# Altium schematic sheet GP2Y_v3_eth.SchDoc
size A1
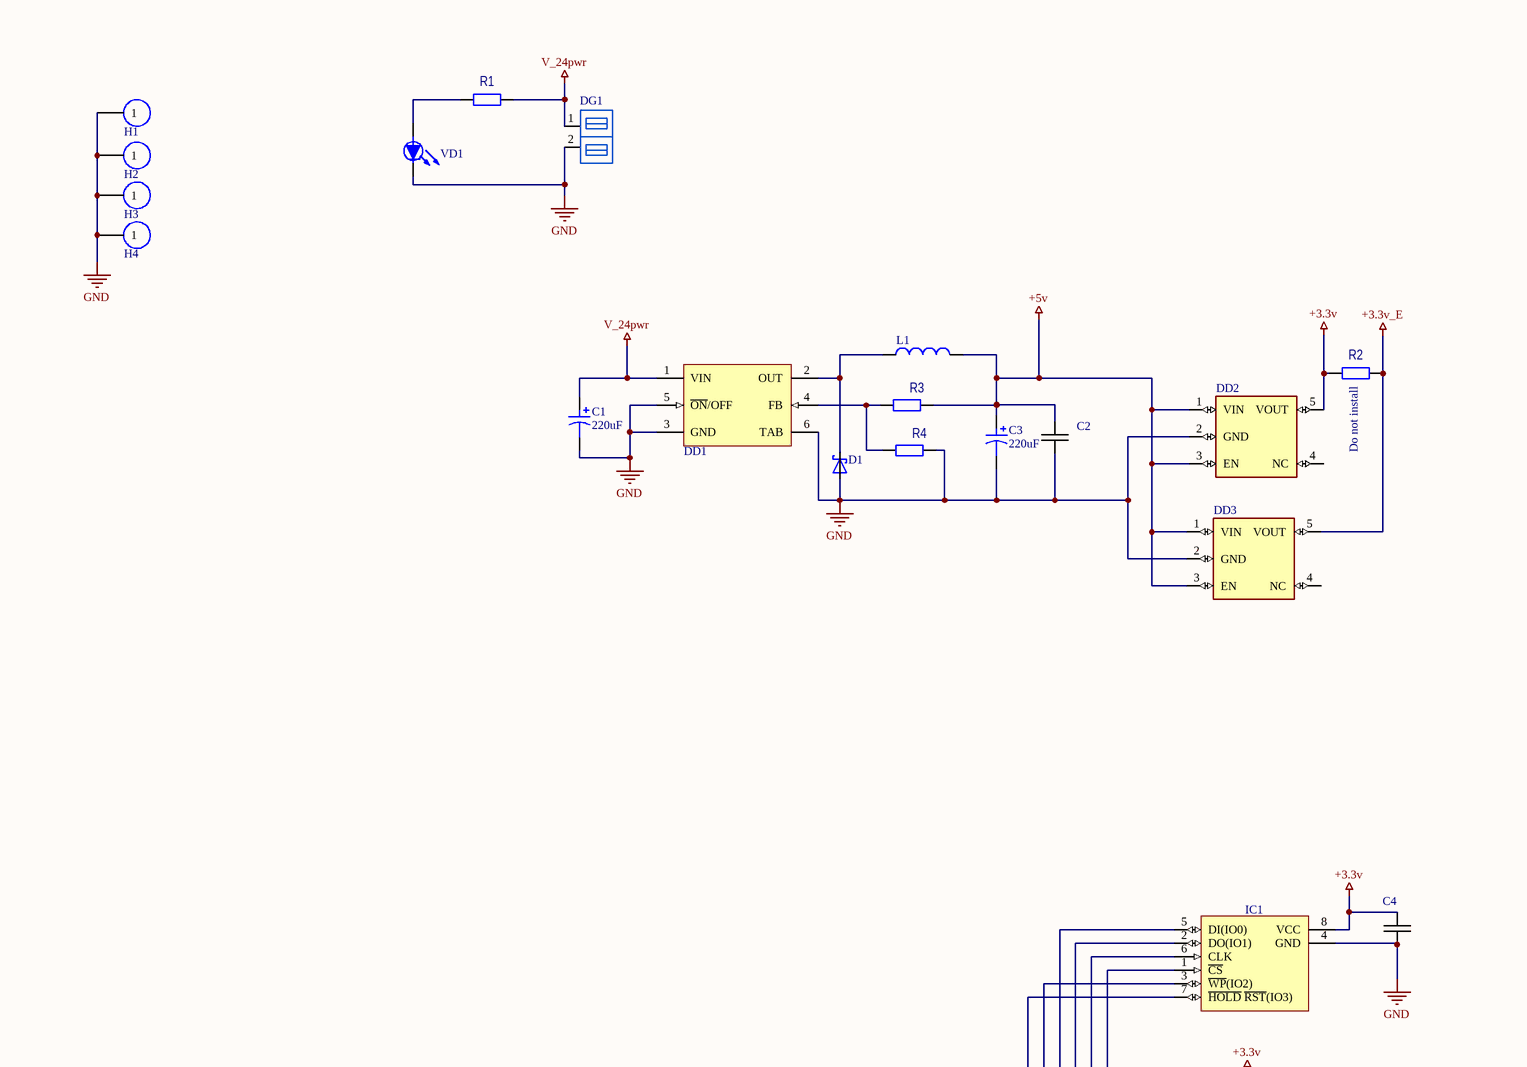
[diagram p0: GP2Y_v3_eth.SchDoc, top left]
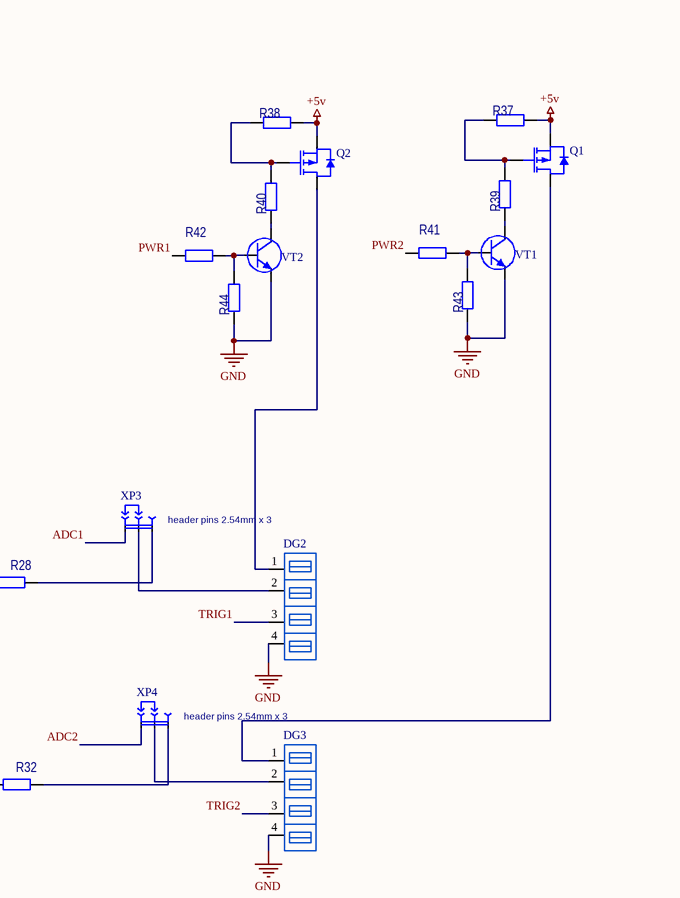
[diagram p1: GP2Y_v3_eth.SchDoc, top right]
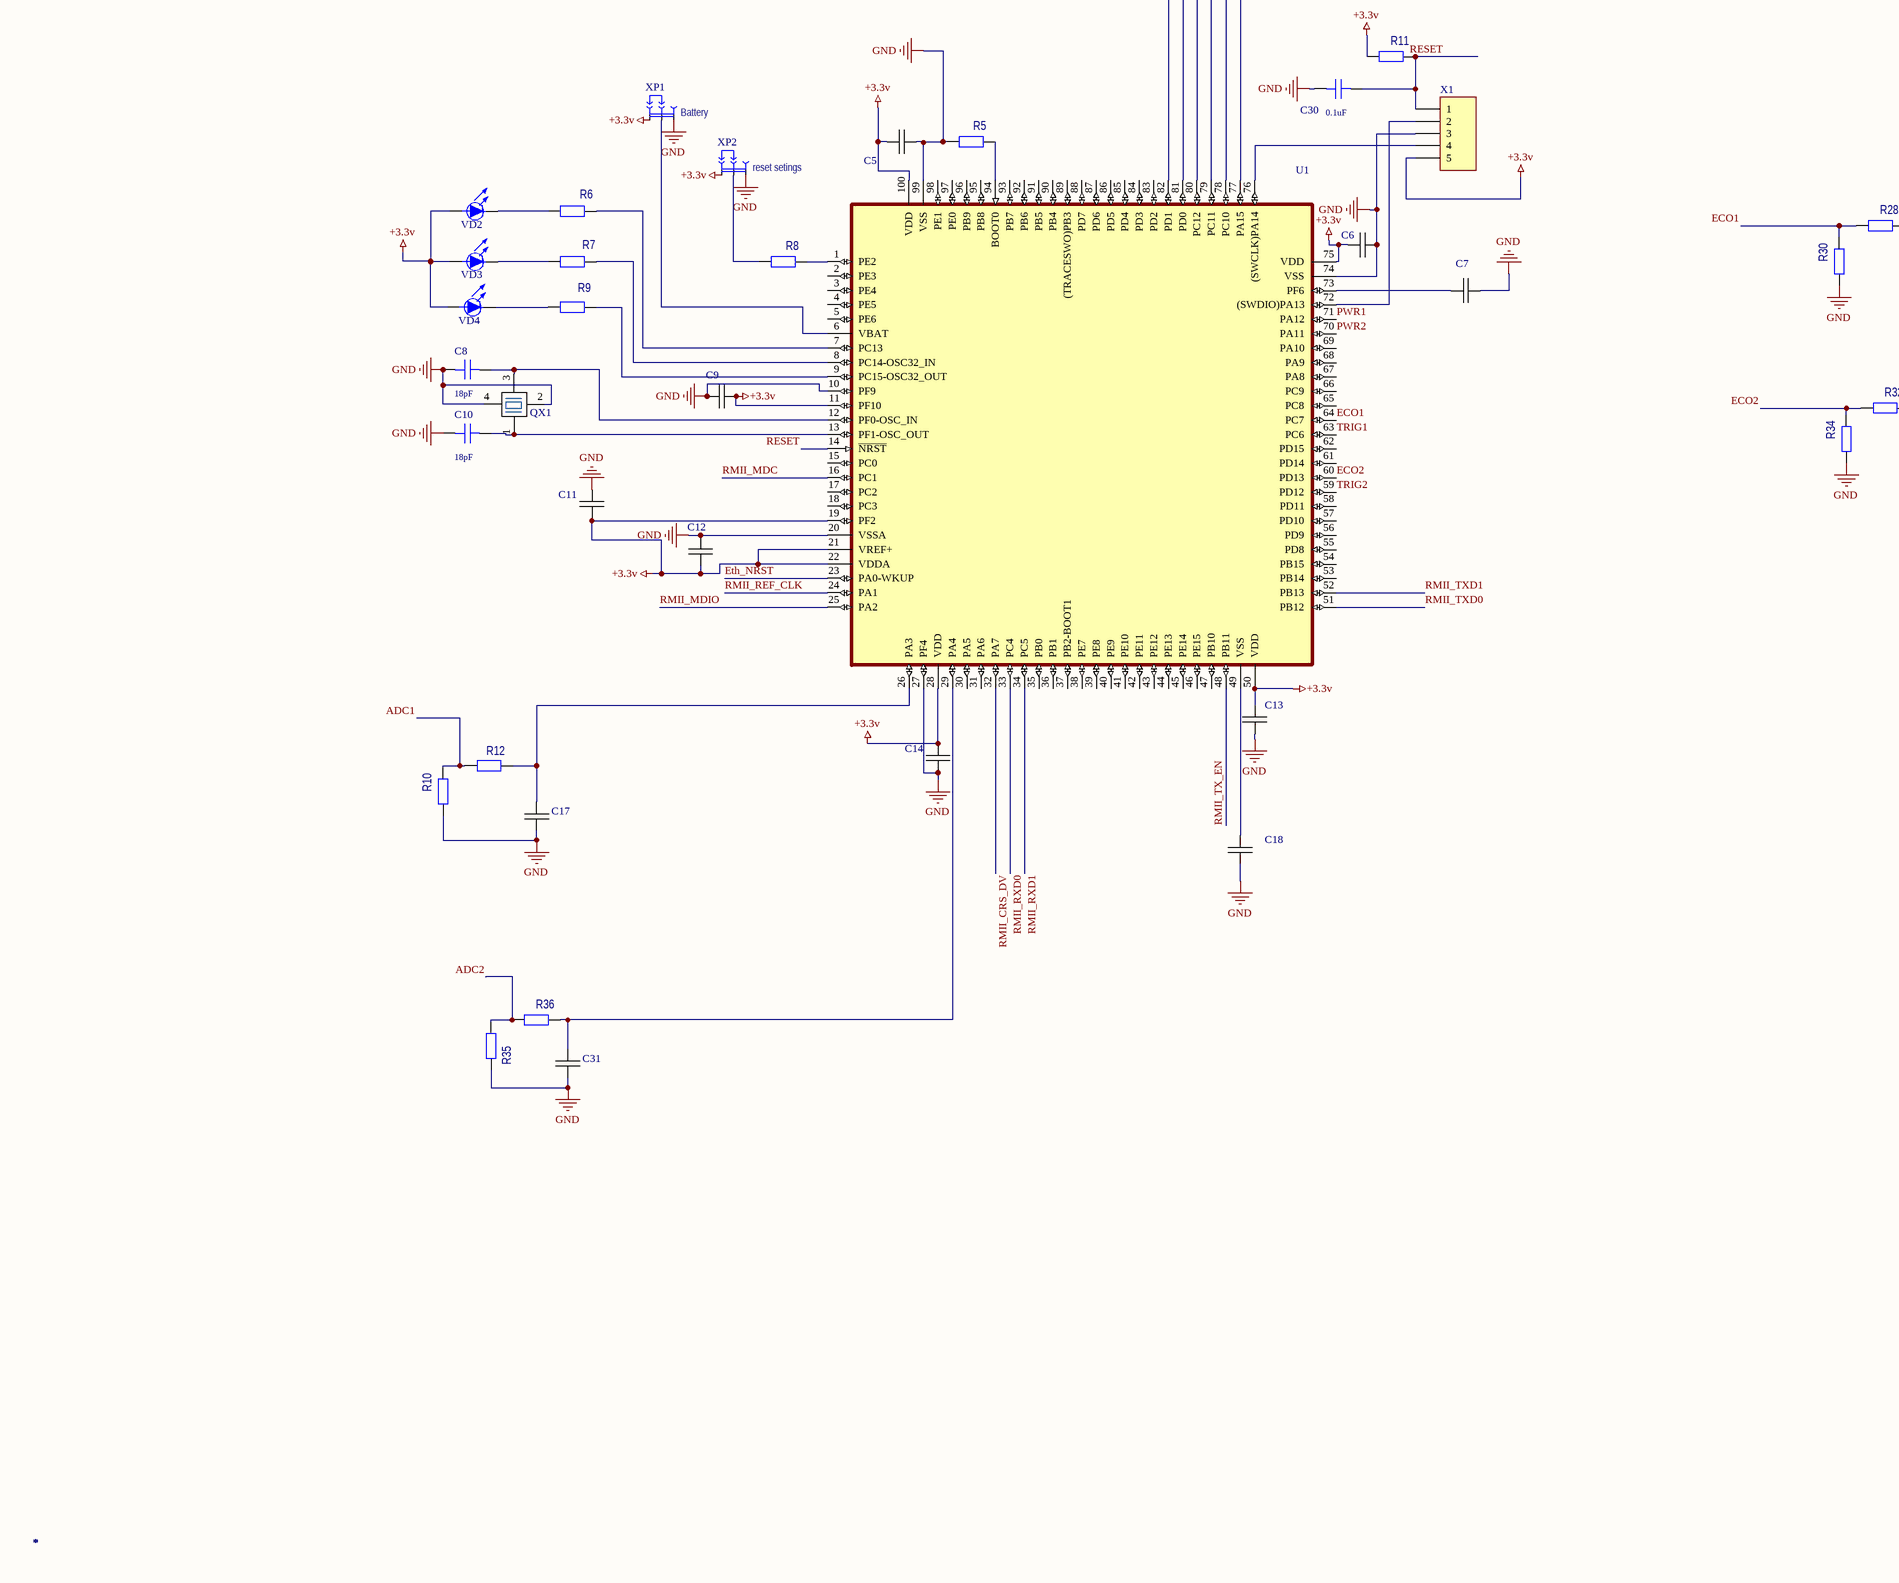
[diagram p2: GP2Y_v3_eth.SchDoc, bottom left]
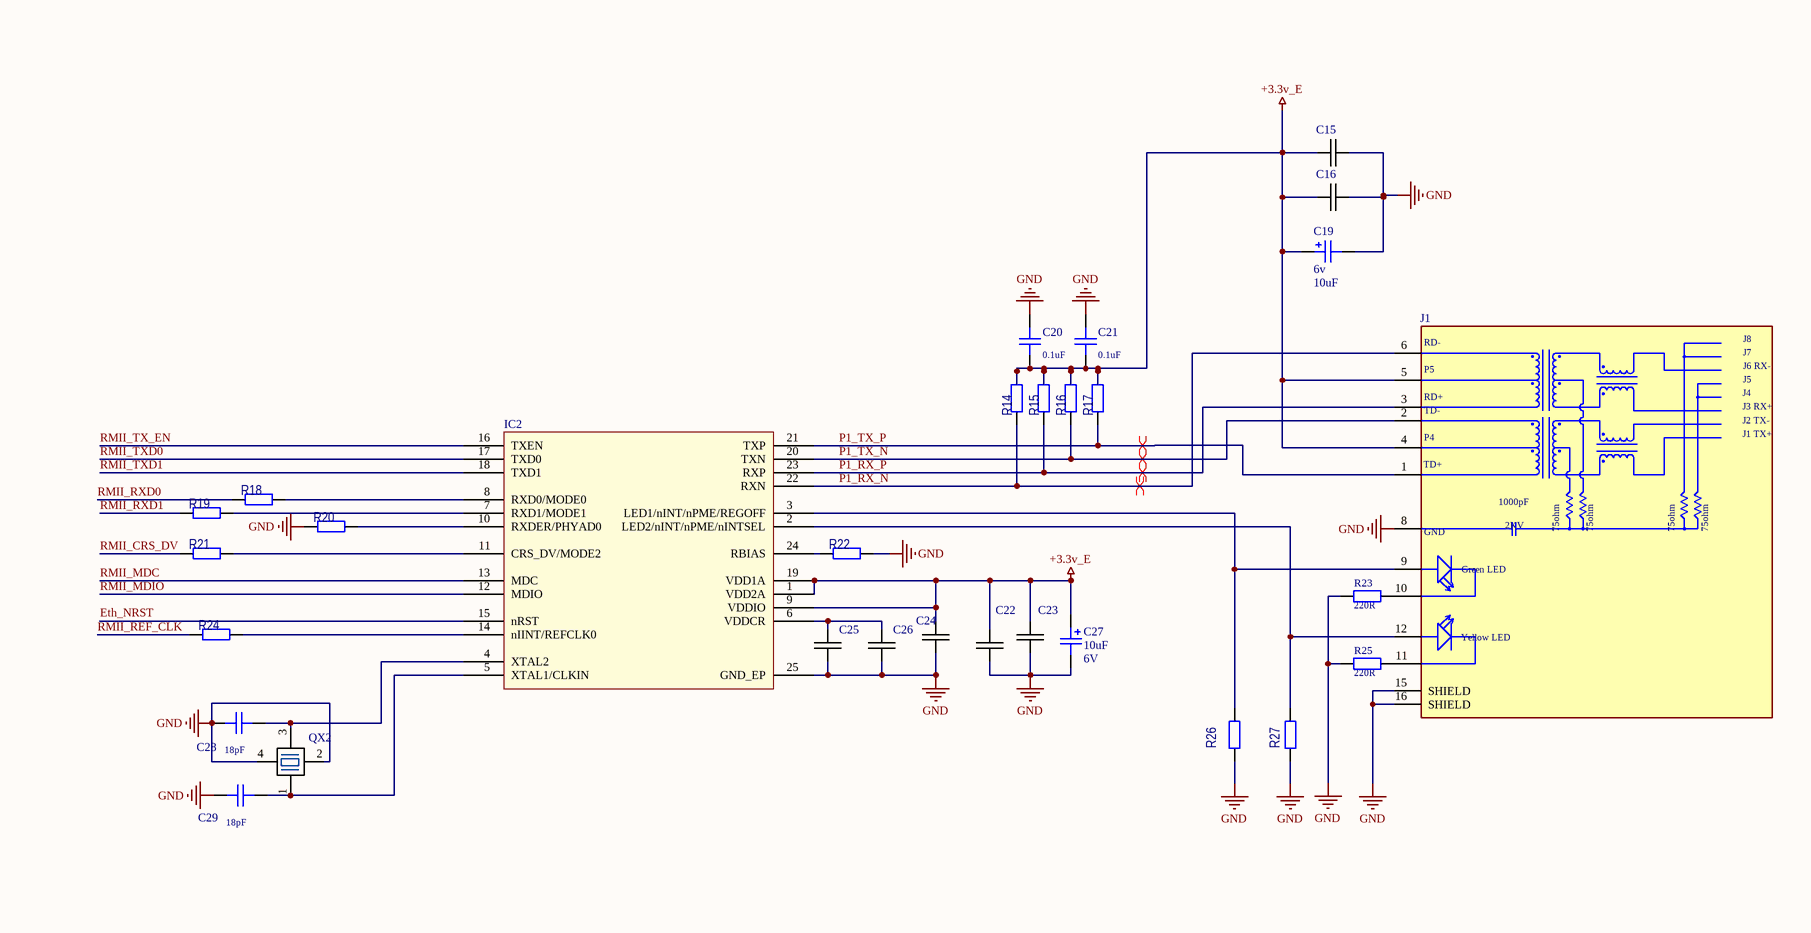
[diagram p3: GP2Y_v3_eth.SchDoc, bottom right]

## Parts
C1  value 220uF  [ECR 10x13mm]
C2  (no value)  [CAPACITOR 0603]
C3  value 220uF  [ECR 10x13mm]
C4  (no value)  [CAPACITOR 0603]
C5  (no value)  [CAPACITOR 0603]
C6  (no value)  [CAPACITOR 0603]
C7  (no value)  [CAPACITOR 0805]
C8  value 18pF  [CAPCHIP0603]
C9  (no value)  [CAPACITOR 0603]
C10  value 18pF  [CAPCHIP0603]
C11  (no value)  [CAPACITOR 0603]
C12  (no value)  [CAPACITOR 0603]
C13  (no value)  [CAPACITOR 0603]
C14  (no value)  [CAPACITOR 0603]
C15  (no value)  [CAPACITOR 0603]
C16  (no value)  [CAPACITOR 0603]
C17  (no value)  [CAPACITOR 0603]
C18  (no value)  [CAPACITOR 0805]
C19  value 10uF  Voltage: 6v  [TECAP B]
C20  value 0.1uF  [CAPCHIP0603]
C21  value 0.1uF  [CAPCHIP0603]
C22  (no value)  [CAPACITOR 0603]
C23  (no value)  [CAPACITOR 0603]
C24  (no value)  [CAPACITOR 0603]
C25  (no value)  [CAPACITOR 0603]
C26  (no value)  [CAPACITOR 0603]
C27  value 10uF  Voltage: 6V  [TECAP B]
C28  value 18pF  [CAPCHIP0603]
C29  value 18pF  [CAPCHIP0603]
C30  value 0.1uF  [CAPCHIP0603]
C31  (no value)  [CAPACITOR 0603]
D1  (no value)  [DIOM7958X213N]
DD1  (no value)  [TO-263]
DD2  (no value)  [TSOT23-5L]
DD3  (no value)  [TSOT23-5L]
DG1  (no value)  [dg250-2.5-2]
DG2  (no value)  [dg250-2.5-4]
DG3  (no value)  [dg250-2.5-4]
H1  (no value)  [Hole 3.5]
H2  (no value)  [Hole 3.5]
H3  (no value)  [Hole 3.5]
H4  (no value)  [Hole 3.5]
IC1  (no value)  [NSO8]
IC2  (no value)  [LAN8742A]
J1  (no value)  [HANRUN_HR911105A]
L1  (no value)  [SRR1208]
Q1  (no value)  [SOT23]
Q2  (no value)  [SOT23]
QX1  (no value)  [XTAL_3.2_2.5]
QX2  (no value)  [XTAL_3.2_2.5]
R1  (no value)  [RESCHIP0603]
R2  Do not install  [RESCHIP0603]
R3  (no value)  [RESCHIP0603]
R4  (no value)  [RESCHIP0603]
R5  (no value)  [RESCHIP0603]
R6  (no value)  [RESCHIP0603]
R7  (no value)  [RESCHIP0603]
R8  (no value)  [RESCHIP0603]
R9  (no value)  [RESCHIP0603]
R10  (no value)  [RESCHIP0603]
R11  (no value)  [RESCHIP0603]
R12  (no value)  [RESCHIP0603]
R14  (no value)  [RESCHIP0603]
R15  (no value)  [RESCHIP0603]
R16  (no value)  [RESCHIP0603]
R17  (no value)  [RESCHIP0603]
R18  (no value)  [RESCHIP0603]
R19  (no value)  [RESCHIP0603]
R20  (no value)  [RESCHIP0603]
R21  (no value)  [RESCHIP0603]
R22  (no value)  [RESCHIP0603]
R23  value 220R  [RESCHIP0603]
R24  (no value)  [RESCHIP0603]
R25  value 220R  [RESCHIP0603]
R26  (no value)  [RESCHIP0603]
R27  (no value)  [RESCHIP0603]
R28  (no value)  [RESCHIP0603]
R30  (no value)  [RESCHIP0603]
R32  (no value)  [RESCHIP0603]
R34  (no value)  [RESCHIP0603]
R35  (no value)  [RESCHIP0603]
R36  (no value)  [RESCHIP0603]
R37  (no value)  [RESCHIP0603]
R38  (no value)  [RESCHIP0603]
R39  (no value)  [RESCHIP0603]
R40  (no value)  [RESCHIP0603]
R41  (no value)  [RESCHIP0603]
R42  (no value)  [RESCHIP0603]
R43  (no value)  [RESCHIP0603]
R44  (no value)  [RESCHIP0603]
U1  (no value)  [QFP50P1600X1600X160-100N]
VD1  (no value)  [0805-]
VD2  (no value)  [0805-]
VD3  (no value)  [0805-]
VD4  (no value)  [0805-]
VT1  (no value)  [SOT23]
VT2  (no value)  [SOT23]
X1  (no value)  [PLS-5-3D]
XP1  value Battery  [ZL201-3]
XP2  value reset setings  [ZL201-3]
XP3  Comments: header pins 2.54mm x 3  [ZL201-3]
XP4  Comments: header pins 2.54mm x 3  [ZL201-3]

## Nets
+3.3v: C4.1 C5.1 C6.1 C9.2 C11.2 C12.2 C13.1 C14.1 DD2.5(VOUT) IC1.8(VCC) R2.1 R11.1 U1.11(PF10) U1.19(PF2) U1.21(VREF+) U1.22(VDDA) U1.28(VDD) U1.50(VDD) U1.75(VDD) U1.100(VDD) VD2.A(a) VD3.A(a) VD4.A(a) X1.5 XP1.1 XP2.1
+3.3v_E: C15.1 C16.1 C19.1 C20.1 C21.1 C22.1 C23.2 C24.1 C27.1 DD3.5(VOUT) IC2.1(VDD2A) IC2.9(VDDIO) IC2.19(VDD1A) J1.4(P4) J1.5(P5) R2.2 R14.2 R15.2 R16.2 R17.2
+5v: C2.2 C3.1 DD2.1(VIN) DD2.3(EN) DD3.1(VIN) DD3.3(EN) L1.P$2 Q1.2(S) Q2.2(S) R3.2 R37.2 R38.2
GND: C1.2 C2.1 C3.2 C4.2 C5.2 C6.2 C7.2 C8.1 C9.1 C10.1 C11.1 C12.1 C13.2 C14.2 C15.2 C16.2 C17.1 C18.1 C19.2 C20.2 C21.2 C22.2 C23.1 C24.2 C25.2 C26.2 C27.2 C28.1 C29.1 C30.1 C31.1 D1.A DD1.3(GND) DD1.5(~{ON}/OFF) DD1.6(TAB) DD2.2(GND) DD3.2(GND) DG1.2 DG2.4 DG3.4 H1.1 H2.1 H3.1 H4.1 IC1.4(GND) IC2.25(GND_EP) J1.8(GND) J1.15(SHIELD) J1.16(SHIELD) QX1.2 QX1.4 QX2.2 QX2.4 R4.2 R5.1 R10.1 R20.1 R22.2 R23.1 R25.1 R26.1 R27.1 R30.1 R34.1 R35.2 R43.1 R44.1 U1.10(PF9) U1.20(VSSA) U1.27(PF4) U1.74(VSS) U1.99(VSS) VD1.K(k) VT1.2(E) VT2.2(E) X1.3 XP1.3 XP2.3
V_24pwr: C1.1 DD1.1(VIN) DG1.1 R1.2
ADC1: R10.2 R12.2 XP3.1
ADC2: R35.1 R36.1 XP4.1
ECO1: R28.1 R30.2 U1.64(PC7)
ECO2: R32.1 R34.2 U1.60(PD13)
Eth_NRST: IC2.15(nRST) U1.23(PA0-WKUP)
P1_RX_N: IC2.22(RXN) J1.6(RD-) R14.1
P1_RX_P: IC2.23(RXP) J1.3(RD+) R15.1
P1_TX_N: IC2.20(TXN) J1.2(TD-) R16.1
P1_TX_P: IC2.21(TXP) J1.1(TD+) R17.1
PWR1: R42.1 U1.71(PA12)
PWR2: R41.1 U1.70(PA11)
RESET: C30.2 R11.2 U1.14(~{NRST}) X1.1
RMII_CRS_DV: R21.1 U1.32(PA7)
RMII_MDC: IC2.13(MDC) U1.16(PC1)
RMII_MDIO: IC2.12(MDIO) U1.25(PA2)
RMII_REF_CLK: R24.1 U1.24(PA1)
RMII_RXD0: R18.1 U1.33(PC4)
RMII_RXD1: R19.1 U1.34(PC5)
RMII_TX_EN: IC2.16(TXEN) U1.48(PB11)
RMII_TXD0: IC2.17(TXD0) U1.51(PB12)
RMII_TXD1: IC2.18(TXD1) U1.52(PB13)
TRIG1: DG2.3 U1.63(PC6)
TRIG2: DG3.3 U1.59(PD12)
NetC7_1: C7.1 U1.73(PF6)
NetC8_2: C8.2 QX1.3 U1.12(PF0-OSC_IN)
NetC10_2: C10.2 QX1.1 U1.13(PF1-OSC_OUT)
NetC17_2: C17.2 R12.1 U1.26(PA3)
NetC18_2: C18.2 U1.49(VSS)
NetC25_1: C25.1 C26.1 IC2.6(VDDCR)
NetC28_2: C28.2 IC2.4(XTAL2) QX2.3
NetC29_2: C29.2 IC2.5(XTAL1/CLKIN) QX2.1
NetC31_2: C31.2 R36.2 U1.29(PA4)
NetD1_C: D1.C DD1.2(OUT) L1.P$1
NetDD1_4: DD1.4(FB) R3.1 R4.1
NetDG2_1: DG2.1 Q2.3(D)
NetDG2_2: DG2.2 XP3.2
NetDG3_1: DG3.1 Q1.3(D)
NetDG3_2: DG3.2 XP4.2
NetIC1_1: IC1.1(~{CS}) U1.77(PA15)
NetIC1_2: IC1.2(DO(IO1)) U1.79(PC11)
NetIC1_3: IC1.3(~{WP}(IO2)) U1.81(PD0)
NetIC1_5: IC1.5(DI(IO0)) U1.80(PC12)
NetIC1_6: IC1.6(CLK) U1.78(PC10)
NetIC1_7: IC1.7(~{HOLD}_~{RST}(IO3)) U1.82(PD1)
NetIC2_2: IC2.2(LED2/nINT/nPME/nINTSEL) J1.12(YA) R27.2
NetIC2_3: IC2.3(LED1/nINT/nPME/REGOFF) J1.9(GA) R26.2
NetIC2_7: IC2.7(RXD1/MODE1) R19.2
NetIC2_8: IC2.8(RXD0/MODE0) R18.2
NetIC2_10: IC2.10(RXDER/PHYAD0) R20.2
NetIC2_11: IC2.11(CRS_DV/MODE2) R21.2
NetIC2_14: IC2.14(nIINT/REFCLK0) R24.2
NetIC2_24: IC2.24(RBIAS) R22.1
NetJ1_10: J1.10(GC) R23.2
NetJ1_11: J1.11(YC) R25.2
NetQ1_1: Q1.1(G) R37.1 R39.2
NetQ2_1: Q2.1(G) R38.1 R40.2
NetR1_1: R1.1 VD1.A(a)
NetR5_2: R5.2 U1.94(BOOT0)
NetR6_1: R6.1 U1.7(PC13)
NetR6_2: R6.2 VD2.K(k)
NetR7_1: R7.1 U1.8(PC14-OSC32_IN)
NetR7_2: R7.2 VD3.K(k)
NetR8_1: R8.1 XP2.2
NetR8_2: R8.2 U1.1(PE2)
NetR9_1: R9.1 U1.9(PC15-OSC32_OUT)
NetR9_2: R9.2 VD4.K(k)
NetR28_2: R28.2 XP3.3
NetR32_2: R32.2 XP4.3
NetR39_1: R39.1 VT1.3(C)
NetR40_1: R40.1 VT2.3(C)
NetR41_2: R41.2 R43.2 VT1.1(B)
NetR42_2: R42.2 R44.2 VT2.1(B)
NetU1_6: U1.6(VBAT) XP1.2
NetU1_72: U1.72((SWDIO)PA13) X1.2
NetU1_76: U1.76((SWCLK)PA14) X1.4

Not connected (* = marked no-connect by the designer): DD2 4(NC); DD3 4(NC); U1 2(PE3) 3(PE4) 4(PE5) 5(PE6) 15(PC0) 17(PC2) 18(PC3) 30(PA5) 31(PA6) 35(PB0) 36(PB1) 37(PB2-BOOT1) 38(PE7) 39(PE8) 40(PE9) 41(PE10) 42(PE11) 43(PE12) 44(PE13) 45(PE14) 46(PE15) 47(PB10) 53(PB14) 54(PB15) 55(PD8) 56(PD9) 57(PD10) 58(PD11) 61(PD14) 62(PD15) 65(PC8) 66(PC9) 67(PA8) 68(PA9) 69(PA10) 83(PD2) 84(PD3) 85(PD4) 86(PD5) 87(PD6) 88(PD7) 89((TRACESWO)PB3) 90(PB4) 91(PB5) 92(PB6) 93(PB7) 95(PB8) 96(PB9) 97(PE0) 98(PE1)

## Layout directives
differential pair: P1_RX_N, P1_RX_P, P1_TX_N, P1_TX_P

## Notes on the sheet
- (in symbol HR911105A) J8; J7; J6 RX-; J5; J4; J3 RX+; J2 TX-; J1 TX+; 1000pF; 2KV; 75ohm; Green LED; Yellow LED

## Library data of the parts
C1 C3 = Cap Pol: Polarized Capacitor (Rad); PartNumber: ECR221M50BA; Voltage: 50; CompType: Cappactor; Tolerance_Percent: ±20%; Package: ECR 10x13mm; Pins: 2
C2 C4-C6 C9 C11-C17 C22-C25 C31 = Capasitor: SMD C0603; Value: 0.1uF; CompType: Cappactor; Package: 0603; Pins: 2
C7 C18 = Capasitor: Value: 2.2uF; CompType: Cappactor; Package: 0805; Pins: 2
C8 C10 C20 C21 C28-C30 = Cap C: SMD C0603; CompType: Cappactor; Package: 0603; Pins: 2
C19 C27 = Cap T: Solid Tantalum Surface Mount Capacitors; CompType: Cappactor; Package: TECAP B; Pins: 2; Note: tantalum; Comments: tantalum
C26 = Capasitor: SMD C0603; Value: 1uF; CompType: Cappactor; Package: 0603; Pins: 2
D1 = MBRS540T3G: Diode Schottky 40V 5A Surface Mount SMC; SnapEDA_Link: https://www.snapeda.com/parts/MBRS540T3G/ON%20Semiconductor/view-part/78777/?ref=snap; Package: DO-214 ON Semiconductor; CompType: Diode; PartNumber: MBRS540T3G; Pins: 2; Voltage: 40v; Note: Diode Schottky 40V 5A Surface Mount SMC
DD1 = LM2596S-ADJ: Power Converter 150 KHz 3A Step-Down Voltage Regulator, 5-pin TO-263; CompType: DC-DC stepdown; PartNumber: LM2596S-ADJ; Value: LM2596S-ADJ; Package: D2PAK; Pins: 6
DD2 DD3 = ADP122AUJZ-3.3-R7: Linear Voltage Regulator IC 1 Output 300mA TSOT-5; Value: ADP122AUJZ-3.3-R7; SnapEDA_Link: https://www.snapeda.com/parts/ADP122AUJZ-3.3-R7/Analog%20Devices%20Inc./view-part/231148/?ref=snap; Package: TSOT-5 Analog Devices; CompType: IC; PartNumber: ADP122AUJZ-3.3-R7; Pins: 5
DG1 = dg250-2.5-2: CompType: connector; PartNumber: dg250-2.5-2; Pins: 2
DG2 DG3 = dg250-2.5-4: PartNumber: dg250-2.5-2; CompType: connector; Pins: 2
H1-H4 = Hole: Package: Hole; CompType: Hole; Pins: 1
IC1 = W25Q128FVEIG: Serial Flash Memory; Value: GD25Q16CTIGR; CompType: IC; Package: sop8 or ssop8; PartNumber: GD25Q16CTIGR; Pins: 8
IC2 = LAN8742A-CZ-TR: CompType: IC; Value: LAN8742A-CZ-TR; Package: SQFN 24; Pins: 25
J1 = HR911105A: HR911105A Ethernet Interface Arduino Platform Evaluation Expansion Board; CompType: connector; Package: Rj45; Value: *; SnapEDA_Link: https://www.snapeda.com/parts/HR911105A/DFRobot/view-part/214807/?ref=snap; PartNumber: HR911105A; Pins: 10
L1 = SRR1208-6R5ML: Inductor; PartNumber: B82477G4104M000, SRR1208-101YL, CDRH127/LDNP-101MC; Value: 47 uH; Tolerance_Percent: +100%; Note: inductor 47uH ~3A or 100uH ~1.5A; SnapEDA_Link: https://www.snapeda.com/parts/SRR1208-6R5ML/Bourns/view-part/353452/?ref=snap; Package: SMD 2-Pin; CompType: Inductor; Pins: 2
Q1 Q2 = P-ch_SOT23: 20V P-Channel Enhancement Mode MOSFET; PartNumber: IRLML6402; CompType: transistor; Note: P-Channel MO SFET; Package: SOT23; Pins: 3
QX1 = XTAL 2-pin: Value: 12 MHz; CompType: xtal; Note: XTAL 3.2mm x 2.5mm; Package: SMD 4-Pin
QX2 = XTAL 2-pin: Value: 25 MHz; CompType: xtal; Note: XTAL 3.2mm x 2.5mm; Package: SMD 4-Pin
R1 R10-R12 R20 R35 R36 R43 R44 = Res: Resistor; Value: 10K; Tolerance_Percent: {Tolerance_Percent}; Pins: 2; Package: 0603; CompType: Resistor
R2 = Res: Resistor; Value: 0; Tolerance_Percent: {Tolerance_Percent}; Pins: 2; Package: 0603; CompType: Resistor; Note: Do not install
R3 = Res: Resistor; Value: 3K; Tolerance_Percent: 1%; Pins: 2; Package: 0603; CompType: Resistor
R4 = Res: Resistor; Value: 1K; Tolerance_Percent: 1%; Pins: 2; Package: 0603; CompType: Resistor
R5 R8 = Res: Resistor; Value: 510R; Tolerance_Percent: {Tolerance_Percent}; Pins: 2; Package: 0603; CompType: Resistor
R6 R7 R9 R37 R38 = Res: Resistor; Value: 3K; Tolerance_Percent: {Tolerance_Percent}; Pins: 2; Package: 0603; CompType: Resistor
R14-R17 = Res: Resistor; Value: 50R; Tolerance_Percent: {Tolerance_Percent}; Pins: 2; Package: 0603; CompType: Resistor
R18 R19 R21 R24 = Res: Resistor; Value: 33R; Tolerance_Percent: {Tolerance_Percent}; Pins: 2; Package: 0603; CompType: Resistor
R22 = Res: Resistor; Value: 12.1k; Tolerance_Percent: {Tolerance_Percent}; Pins: 2; Package: 0603; CompType: Resistor
R23 R25 = Res: Resistor SMD R0603; Package: 0603; CompType: Resistor; Pins: 2
R26 R27 R41 R42 = Res: Resistor; Value: 1.5K; Tolerance_Percent: {Tolerance_Percent}; Pins: 2; Package: 0603; CompType: Resistor
R28 R32 = Res: Resistor; Value: 1K; Tolerance_Percent: {Tolerance_Percent}; Pins: 2; Package: 0603; CompType: Resistor
R30 R34 = Res: Resistor; Value: 2K; Tolerance_Percent: {Tolerance_Percent}; Pins: 2; Package: 0603; CompType: Resistor
R39 R40 = Res: Resistor; Value: 220R; Tolerance_Percent: {Tolerance_Percent}; Pins: 2; Package: 0603; CompType: Resistor
U1 = STM32F303V: STM32F407VE Microcontroller IC 32-Bit 100-LQFP (14x14); Value: STM32F407VE; Package: LQFP-100 STMicroelectronics; CompType: IC; PartNumber: Stm32f407VE; Pins: 100
VD1 = LED SMD: Value: 0805; CompType: LED; Pins: 2; Package: 0805
VD2 = LED SMD: Value: 0805; CompType: LED; Note: Read; Pins: 2; Package: 0805
VD3 = LED SMD: Value: 0805; CompType: LED; Note: Green; Pins: 2; Package: 0805
VD4 = LED SMD: Value: 0805; CompType: LED; Note: Blue; Pins: 2; Package: 0805
VT1 VT2 = BC846: NPN Bipolar Transistor; Value: BC846; Package: SOT23; CompType: transistor; PartNumber: BC846; Pins: 3; Note: NPN
X1 = PLS-5: Header, 5-Pin; CompType: connector; Note: header pins 2.54mm x 5; Package: 2.54 x 5; PartNumber: PLS-5; Pins: 5
XP1 = Select jump: PartNumber: PLS-3; CompType: connector; Note: header pins 2.54mm x 3; Pins: 3; Package: 2.54 x 3
XP2 = Select jump: Ter120; PartNumber: PLS-3; CompType: connector; Note: header pins 2.54mm x 3; Pins: 3; Package: 2.54 x 3
XP3 XP4 = Select jump: Ter120; PartNumber: PLS-3; CompType: connector; Pins: 3; Package: 2.54 x 3; Note: header pins 2.54mm x 3